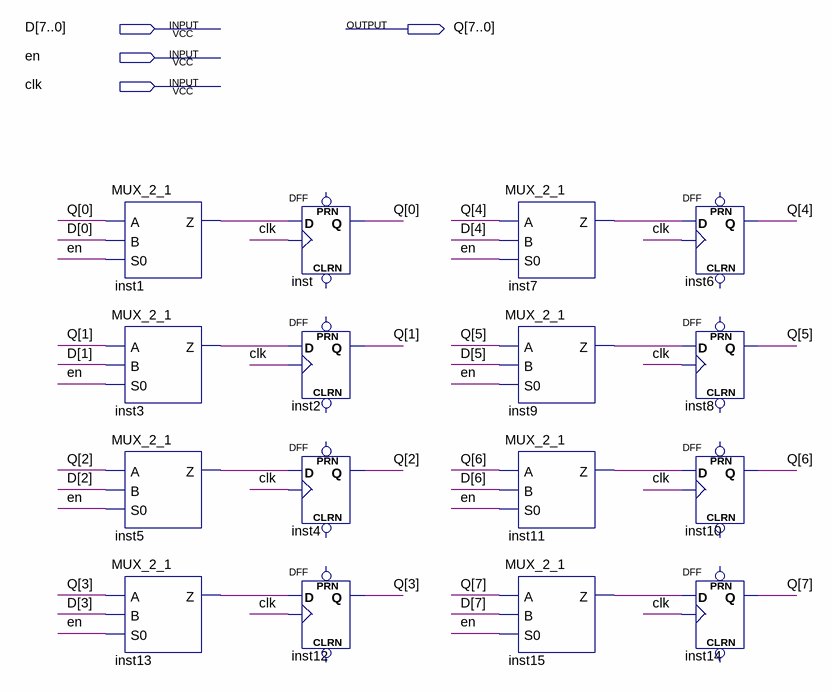
[diagram p0: schematic sheet]
// Quartus schematic REG8b.bdf as structural Verilog: 16 symbols, 4 pins
module REG8b (
  input  [7:0] D,
  input  en,
  input  clk,
  output [7:0] Q
);

  wire inst1_z, inst3_z, inst5_z, inst7_z, inst9_z, inst11_z, inst13_z, inst15_z;

  MUX_2_1 inst1 (.A(Q[0]), .B(D[0]), .S0(en), .Z(inst1_z));
  MUX_2_1 inst3 (.A(Q[1]), .B(D[1]), .S0(en), .Z(inst3_z));
  MUX_2_1 inst5 (.A(Q[2]), .B(D[2]), .S0(en), .Z(inst5_z));
  MUX_2_1 inst13 (.A(Q[3]), .B(D[3]), .S0(en), .Z(inst13_z));
  DFF inst (.CLK(clk), .D(inst1_z), .Q(Q[0]));  // open: CLRN, PRN
  DFF inst2 (.CLK(clk), .D(inst3_z), .Q(Q[1]));  // open: CLRN, PRN
  DFF inst4 (.CLK(clk), .D(inst5_z), .Q(Q[2]));  // open: CLRN, PRN
  DFF inst12 (.CLK(clk), .D(inst13_z), .Q(Q[3]));  // open: CLRN, PRN
  MUX_2_1 inst7 (.A(Q[4]), .B(D[4]), .S0(en), .Z(inst7_z));
  MUX_2_1 inst9 (.A(Q[5]), .B(D[5]), .S0(en), .Z(inst9_z));
  MUX_2_1 inst11 (.A(Q[6]), .B(D[6]), .S0(en), .Z(inst11_z));
  MUX_2_1 inst15 (.A(Q[7]), .B(D[7]), .S0(en), .Z(inst15_z));
  DFF inst6 (.CLK(clk), .D(inst7_z), .Q(Q[4]));  // open: CLRN, PRN
  DFF inst8 (.CLK(clk), .D(inst9_z), .Q(Q[5]));  // open: CLRN, PRN
  DFF inst10 (.CLK(clk), .D(inst11_z), .Q(Q[6]));  // open: CLRN, PRN
  DFF inst14 (.CLK(clk), .D(inst15_z), .Q(Q[7]));  // open: CLRN, PRN
endmodule
